# Altium schematic sheet Connectors.SchDoc
size A; SheetNumber: 2; SheetTotal: 9
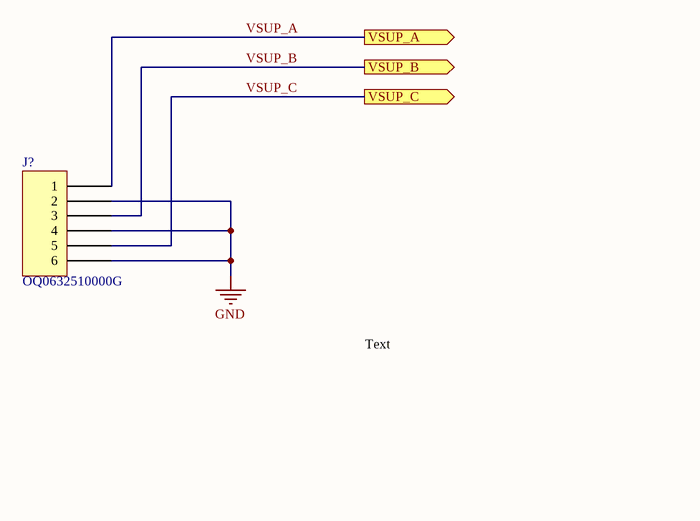
[diagram p0: Connectors.SchDoc]

## Parts
J?  OQ0632510000G  [FCI 06-381-6PIN]

## Ports
VSUP_A (out), VSUP_B (out), VSUP_C (out)

## Nets
GND: J?.2 J?.4 J?.6
VSUP_A: J?.1 ; port VSUP_A
VSUP_B: J?.3 ; port VSUP_B
VSUP_C: J?.5 ; port VSUP_C

## Notes on the sheet
- Text

## Library data of the parts
J? = OQ0632510000G: TERM BLOCK HDR 6POS 90DEG 3.81MM; Manufacturer: Amphenol Anytek; Current - UL: 10A; Header Orientation: 90°, Right Angle; Number of Levels: 1; Number of Positions: 6; Pitch: 0.150" (3.81mm); Voltage - UL: 300V; Part Number: OQ0632510000G; Color: Green; ComponentLink1Description: Datasheet; ComponentLink1URL: http://portal.fciconnect.com/Comergent//fci/drawing/oqxx32x100j0g.pdf; ComponentLink2Description: DigiKey Link; ComponentLink2URL: //digikey.com/product-detail/en/amphenol-anytek/OQ0632510000G/609-3823-ND/2261282; Contact Mating Finish: Tin; LastUpdated: 12/16/2019 7:16:11 PM; Lifecycle Status: 0; Minimum Order: 1; Mounting Type: Through Hole; Operating Temperature: -40°C ~ 115°C; Packaging: Bulk; Part Status: Active; Positions Per Level: 6; Price: 0.80; Series: 06-381; Supplier 1: DigiKey; Supplier Part Number 1: 609-3823-ND; Termination Style: Solder; Type: Header, Male Pins, Shrouded (4 Side)